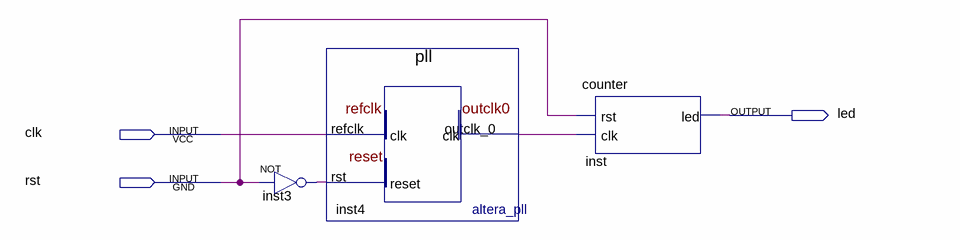
[diagram p0: schematic sheet]
// Quartus schematic led_blink.bdf as structural Verilog: 3 symbols, 3 pins
module led_blink (
  input  clk,
  input  rst,
  output led
);

  wire inst3_out, inst4_outclk_0;

  not inst3 (inst3_out, rst);
  pll inst4 (.refclk(clk), .rst(inst3_out), .outclk_0(inst4_outclk_0));
  counter inst (.rst(rst), .clk(inst4_outclk_0), .led(led));
endmodule
